# EAGLE design iv4_4lw_1.2 (EAGLE 4.16)
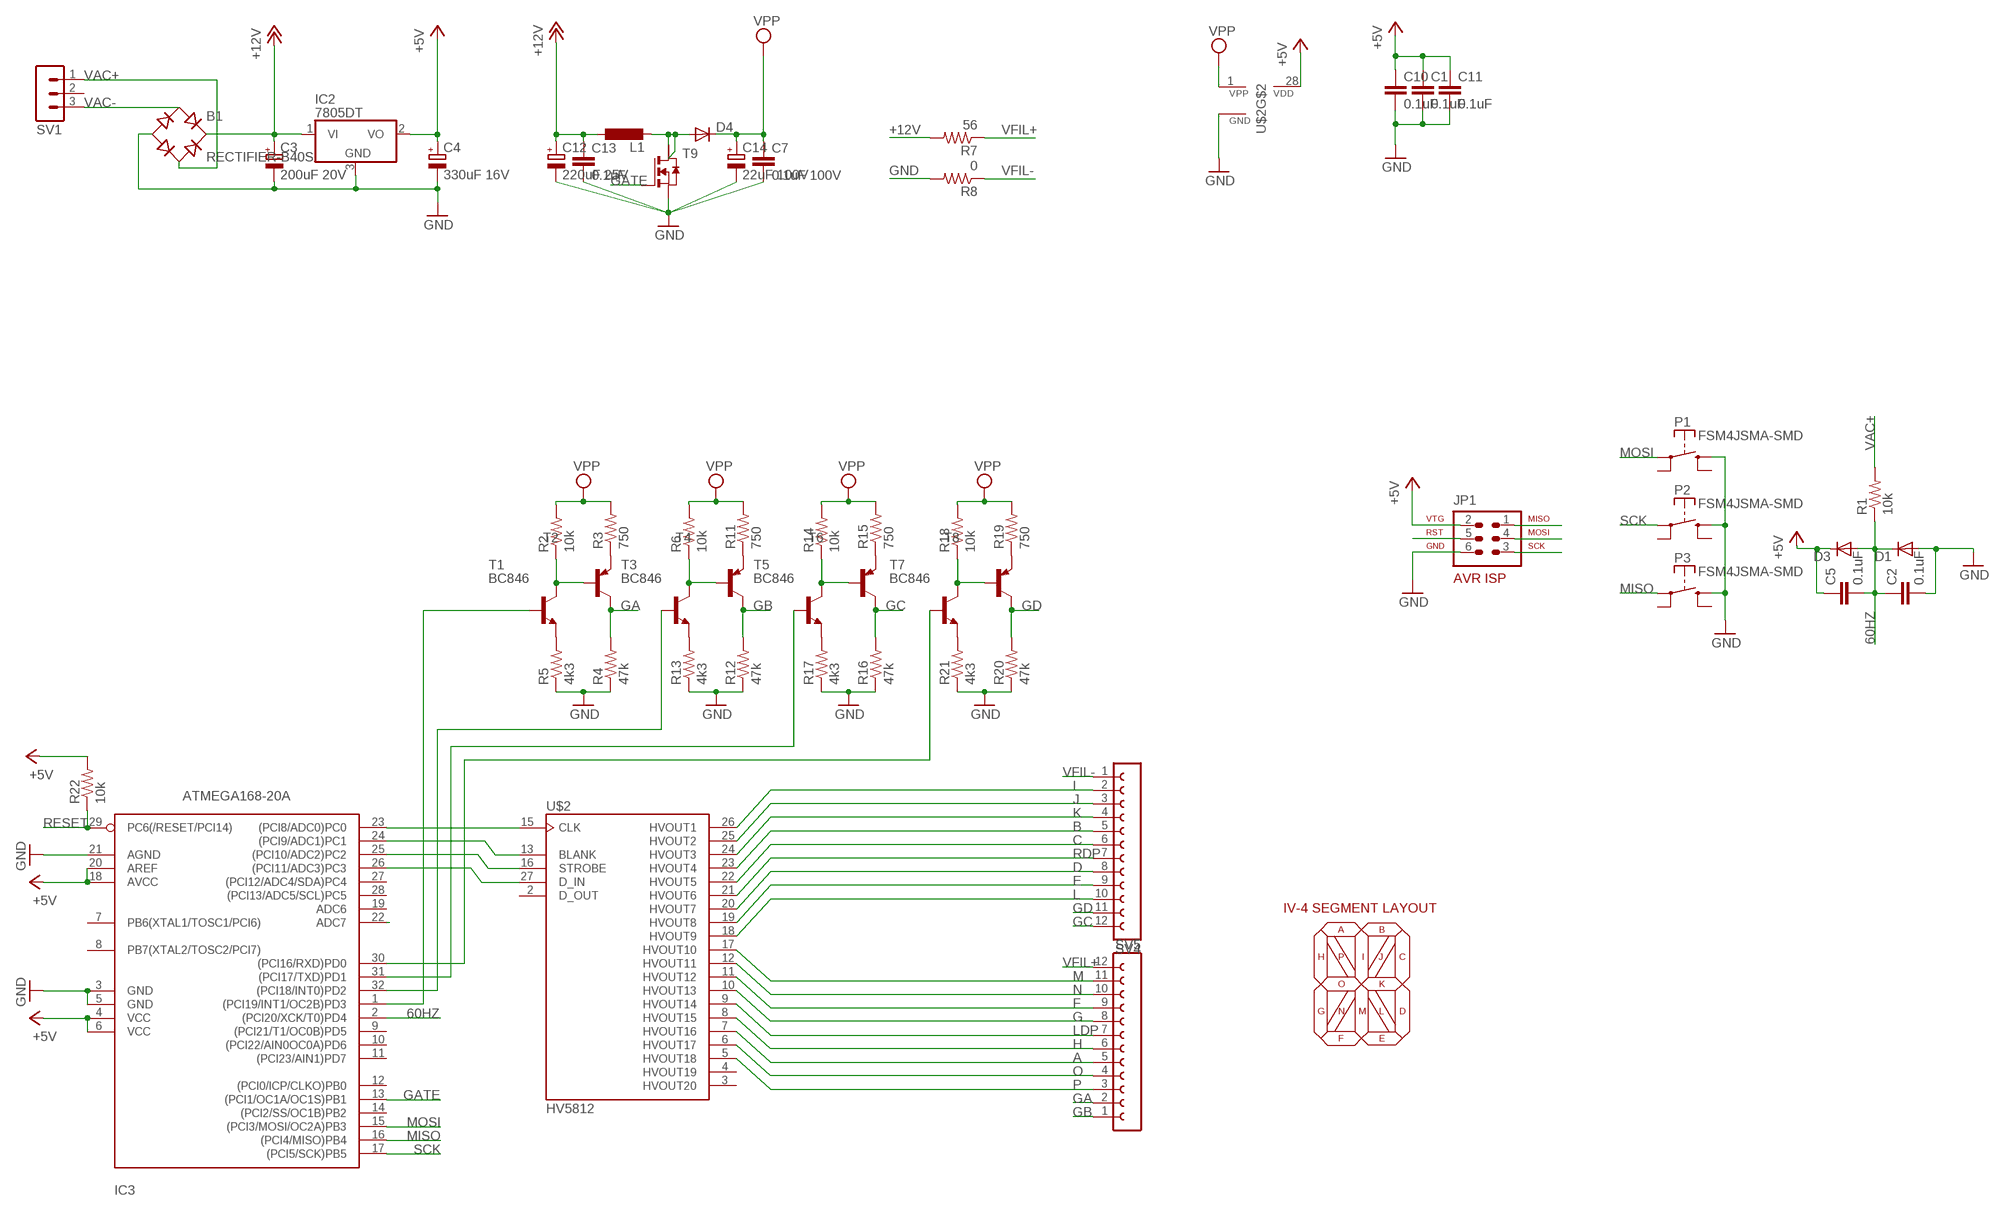
[diagram p0: schematic, sheet 1]

## Parts
B1  RECTIFIER-B40S  [B40S]
C1  0.1uF  C-EUC0805  [C0805]
C2  0.1uF  C-EUC0805  [C0805]
C3  200uF 20V  CPOL-EUE2.5-7  [E2,5-7]
C4  330uF 16V  CPOL-EUE2.5-7  [E2,5-7]
C5  0.1uF  C-EUC0805  [C0805]
C7  0.1uF 100V  C-EUC1206  [C1206]
C10  0.1uF  C-EUC0805  [C0805]
C11  0.1uF  C-EUC0805  [C0805]
C12  220uF 25V  CPOL-EUE2.5-7  [E2,5-7]
C13  0.1uF  C-EUC0805  [C0805]
C14  22uF 100V  CPOL-EUE2.5-7  [E2,5-7]
D1  DIODE-SOD123  [SOD123]
D3  DIODE-SOD123  [SOD123]
D4  DIODE-DO214AC  [DO214AC]
IC2  7805DT  [TO252]
IC3  ATMEGA168-20A  [TQFP32-08]
JP1  AVR-ISP-6  [AVR-ISP-6]
L1  DO3316P  [DO3316P]
P1  FSM4JSMA-SMD  [FSM4JSMA-SMD]
P2  FSM4JSMA-SMD  [FSM4JSMA-SMD]
P3  FSM4JSMA-SMD  [FSM4JSMA-SMD]
R1  10k  R-US_R0805  [R0805]
R2  10k  R-US_R0805  [R0805]
R3  750  R-US_R0805  [R0805]
R4  47k  R-US_R0805  [R0805]
R5  4k3  R-US_R0805  [R0805]
R6  10k  R-US_R0805  [R0805]
R7  56  R-US_M0805  [M0805]
R8  0  R-US_M0805  [M0805]
R11  750  R-US_R0805  [R0805]
R12  47k  R-US_R0805  [R0805]
R13  4k3  R-US_R0805  [R0805]
R14  10k  R-US_R0805  [R0805]
R15  750  R-US_R0805  [R0805]
R16  47k  R-US_R0805  [R0805]
R17  4k3  R-US_R0805  [R0805]
R18  10k  R-US_R0805  [R0805]
R19  750  R-US_R0805  [R0805]
R20  47k  R-US_R0805  [R0805]
R21  4k3  R-US_R0805  [R0805]
R22  10k  R-US_R0805  [R0805]
SV1  MA03-1  [MA03-1]
SV4  FE12-1  [FE12]
SV5  FE12-1  [FE12]
T1  BC846  [SOT23]
T2  BC856A-PNP-SOT23-BEC  [SOT23-BEC]
T3  BC846  [SOT23]
T4  BC856A-PNP-SOT23-BEC  [SOT23-BEC]
T5  BC846  [SOT23]
T6  BC856A-PNP-SOT23-BEC  [SOT23-BEC]
T7  BC846  [SOT23]
T8  BC856A-PNP-SOT23-BEC  [SOT23-BEC]
T9  NMOSSOT223  [SOT223]
U$2  HV5812  [SO28W]

## Nets
60HZ: C2.1 C5.2 D1.C D3.A IC3.2((PCI20/XCK/T0)PD4) R1.1
+5V: C1.1 C4.+ C5.1 C10.1 C11.1 D3.C IC2.2(VO) IC3.4(VCC) IC3.6(VCC) IC3.18(AVCC) IC3.20(AREF) JP1.2 R22.2 U$2.28(VDD)
+12V: B1.+ C3.+ C12.+ C13.1 IC2.1(VI) L1.2 R7.2
A: SV5.5 U$2.7(HVOUT16)
B: SV4.5 U$2.23(HVOUT4)
BLANK: IC3.24((PCI9/ADC1)PC1) U$2.13(BLANK)
C: SV4.6 U$2.22(HVOUT5)
CLK: IC3.23((PCI8/ADC0)PC0) U$2.15(CLK)
D: SV4.8 U$2.20(HVOUT7)
DIN: IC3.26((PCI11/ADC3)PC3) U$2.27(D_IN)
E: SV4.9 U$2.19(HVOUT8)
F: SV5.9 U$2.11(HVOUT12)
G: SV5.8 U$2.10(HVOUT13)
GA: R4.2 SV5.2 T2.C
GATE: IC3.13((PCI1/OC1A/OC1S)PB1) T9.1(G)
GB: R12.2 SV5.1 T4.C
GC: R16.2 SV4.12 T6.C
GD: R20.2 SV4.11 T8.C
GND: B1.- C1.2 C2.2 C3.- C4.- C7.2 C10.2 C11.2 C12.- C13.2 C14.- D1.A IC2.3(GND) IC3.3(GND) IC3.5(GND) IC3.21(AGND) JP1.6 P1.P$3(S) P2.P$3(S) P3.P$3(S) R4.1 R5.1 R8.2 R12.1 R13.1 R16.1 R17.1 R20.1 R21.1 T9.3(S) U$2.14(GND)
H: SV5.6 U$2.8(HVOUT15)
I: SV4.2 U$2.26(HVOUT1)
J: SV4.3 U$2.25(HVOUT2)
K: SV4.4 U$2.24(HVOUT3)
L: SV4.10 U$2.18(HVOUT9)
LDP: SV5.7 U$2.9(HVOUT14)
M: SV5.11 U$2.17(HVOUT10)
MISO: IC3.16((PCI4/MISO)PB4) JP1.1 P3.P$1(P)
MOSI: IC3.15((PCI3/MOSI/OC2A)PB3) JP1.4 P1.P$1(P)
N: SV5.10 U$2.12(HVOUT11)
N$1: D4.A L1.1 T9.2(D) T9.4(D2)
N$6: R2.1 T1.3(C) T2.B
N$7: R3.1 T2.E
N$8: R5.2 T1.2(E)
N$15: R6.1 T3.3(C) T4.B
N$16: R11.1 T4.E
N$17: R13.2 T3.2(E)
N$19: R14.1 T5.3(C) T6.B
N$20: R15.1 T6.E
N$21: R17.2 T5.2(E)
N$23: R18.1 T7.3(C) T8.B
N$24: R19.1 T8.E
N$25: R21.2 T7.2(E)
N$26: IC3.1((PCI19/INT1/OC2B)PD3) T1.1(B)
N$27: IC3.32((PCI18/INT0)PD2) T3.1(B)
N$28: IC3.31((PCI17/TXD)PD1) T5.1(B)
N$29: IC3.30((PCI16/RXD)PD0) T7.1(B)
O: SV5.4 U$2.6(HVOUT17)
P: SV5.3 U$2.5(HVOUT18)
RDP: SV4.7 U$2.21(HVOUT6)
RESET: IC3.22(ADC7) IC3.29(PC6(/RESET/PCI14)) JP1.5 R22.1
SCK: IC3.17((PCI5/SCK)PB5) JP1.3 P2.P$1(P)
STROBE: IC3.25((PCI10/ADC2)PC2) U$2.16(STROBE)
VAC+: B1.AC2 R1.2 SV1.1
VAC-: B1.AC1 SV1.3
VFIL+: R7.1 SV5.12
VFIL-: R8.1 SV4.1
VPP: C7.1 C14.+ D4.C R2.2 R3.2 R6.2 R11.2 R14.2 R15.2 R18.2 R19.2 U$2.1(VPP)
Unconnected: IC3.7(PB6(XTAL1/TOSC1/PCI6)) IC3.8(PB7(XTAL2/TOSC2/PCI7)) IC3.9((PCI21/T1/OC0B)PD5) IC3.10((PCI22/AIN0OC0A)PD6) IC3.11((PCI23/AIN1)PD7) IC3.12((PCI0/ICP/CLKO)PB0) IC3.14((PCI2/SS/OC1B)PB2) IC3.19(ADC6) IC3.27((PCI12/ADC4/SDA)PC4) IC3.28((PCI13/ADC5/SCL)PC5) P1.P$2(P) P1.P$4(S) P2.P$2(P) P2.P$4(S) P3.P$2(P) P3.P$4(S) SV1.2 U$2.2(D_OUT) U$2.3(HVOUT20) U$2.4(HVOUT19)

## Notes on the sheet
- IV-4 SEGMENT LAYOUT
- A | B
- H | P | I | J | C
- O | K
- G | N | M | L | D
- F | E

## Library data of the parts
B1 = rectifier:RECTIFIER-: Rectifier
C1 C2 C5 C7 C10 C11 C13 = rcl:C-EU: CAPACITOR, European symbol
C3 C4 C12 C14 = rcl:CPOL-EU: POLARIZED CAPACITOR, European symbol
D1 D3 D4 = diode:DIODE-: DIODE
IC2 = linear:78*: Positive VOLTAGE REGULATOR Source: http://cache.national.com/ds/LM/LM78L05.pdf http://www.fairchildsemi.com/ds/LM/LM7805.pdf
IC3 = avr:ATMEGA168: MICROCONTROLLER 16 kBytes FLASH 1 kBytes SRAM 512 Bytes EEPROM USART 8-channel 10 bit ADC
JP1 = atmel:AVR-ISP-6: AVR ISP-6 Serial Programming Header
L1 = inductor-coilcraft:DO3316P: COILCRAFT
P1-P3 = switch-misc:FSM4JSMA-SMD: TYCO SWITCH
R1-R8 R11-R22 = rcl:R-US_: RESISTOR, American symbol
SV1 = con-lstb:MA03-1: PIN HEADER
SV4 SV5 = con-lsta:FE12-1: FEMALE HEADER
T1 T3 T5 T7 = transistor:BC846: NPN TRANSISTOR
T2 T4 T6 T8 = transistor:*-PNP-: PNP Transistror
T9 = zetex:NMOSSOT223: MOS FET
U$2 = supertex-hv:HV5812

## Board
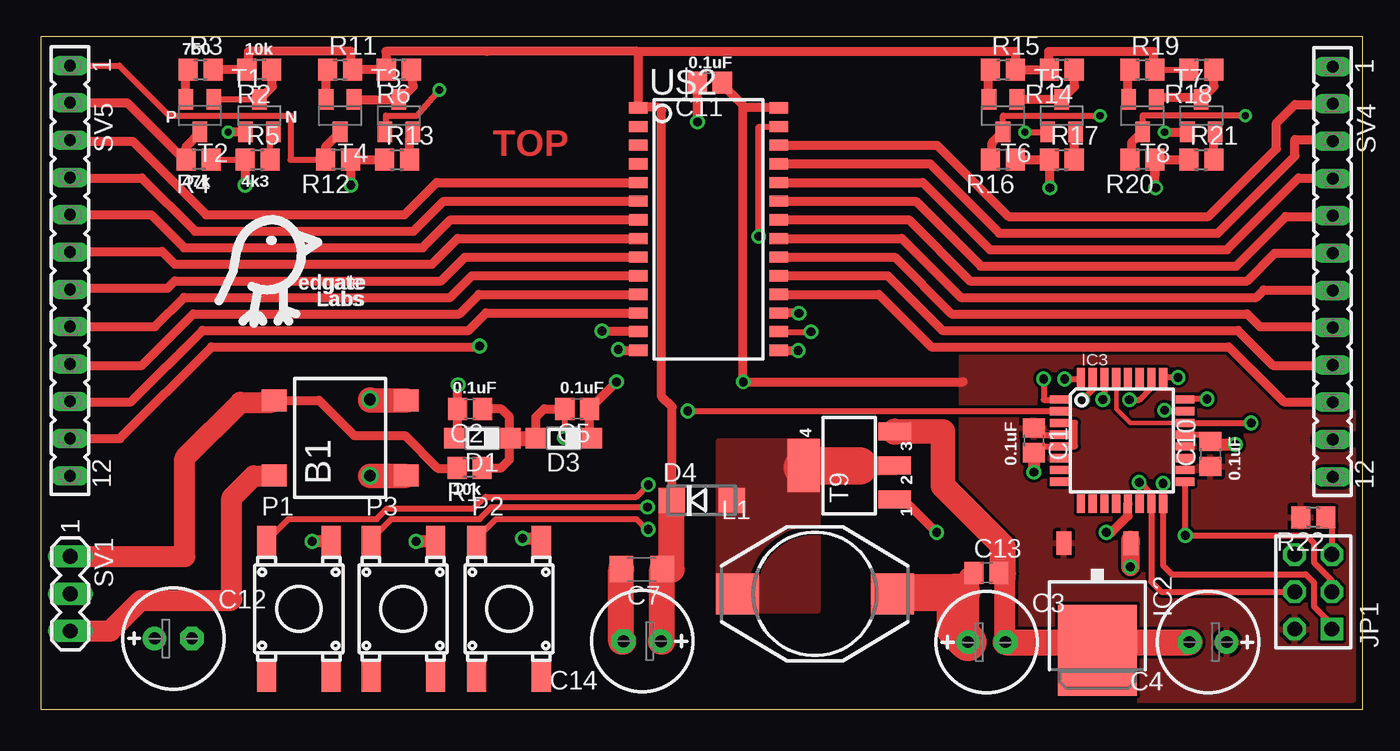
[diagram p1: board, top side]
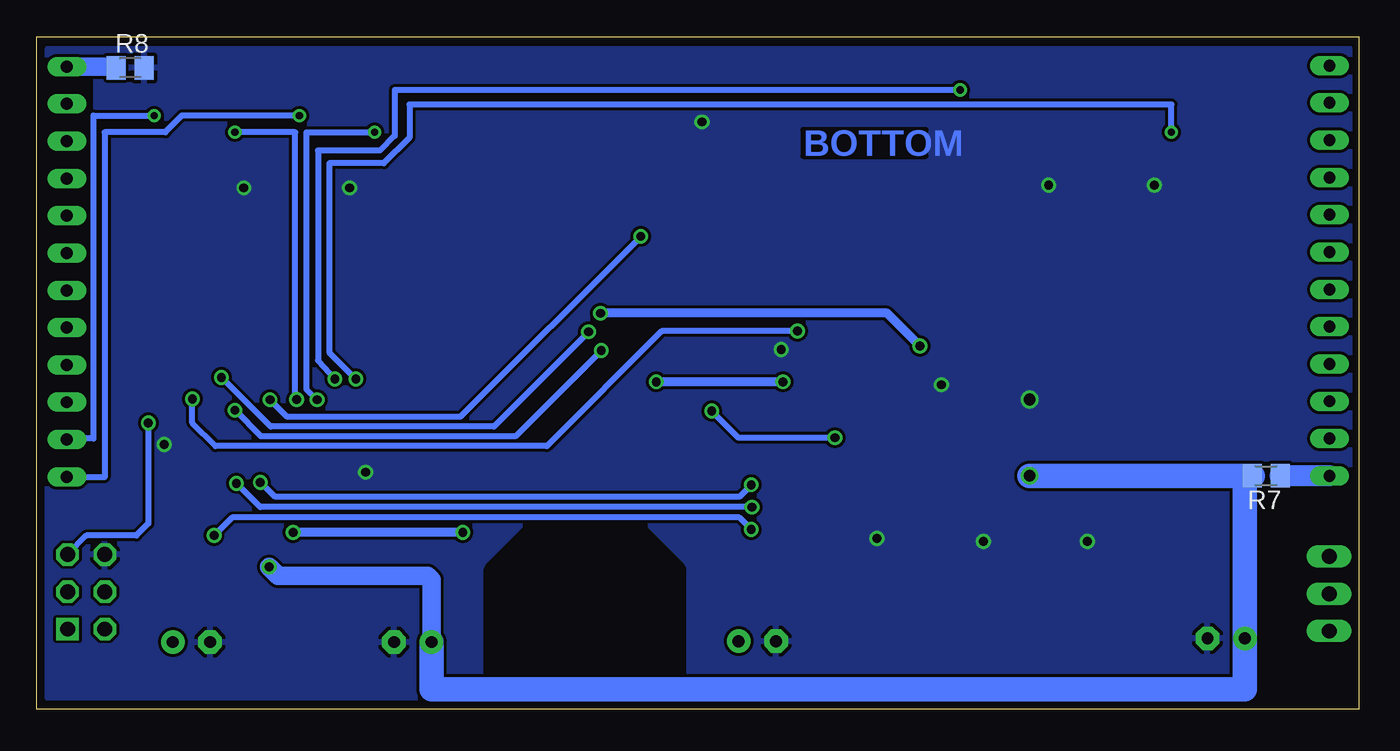
[diagram p2: board, bottom side, seen from below]

Size 90 x 45.81 mm. Coordinates in mm from the lower left corner, seen from the top.
Outline: 0,0 90,0 90,45.82 0,45.81 0,0
Copper layers (1*16): Top 0.0356mm / dielectric 1.5011mm / Bottom 0.0356mm
Design rules "default *": minimum track width 10mil, minimum drill 5mil, track to track 8mil, track to pad 0.1727mm, pad to pad 8mil, via to via 8mil, smd to smd 5mil, copper to edge 10mil, drill to drill 8mil, minimum pad ring 10mil, minimum via ring 8mil, stop-mask expansion 4mil, vias tented up to drill 0mil, thermal gap 10mil
tRestrict: 1 lines
bRestrict: 7 lines

### Footprints (pad centres in the part's own frame; a part is rotated, then mirrored left to right if it is on the bottom)
B40S = smd 1.5 x 1.7: + -2.55,-4.5; - 2.55,-4.5; AC1 -2.55,4.5; AC2 2.55,4.5
C0805 = smd 1.3 x 1.5: 1 -0.85,0; 2 0.85,0
E2,5-7 = drill 0.813 pad 1.6 round: + -1.27,0 | drill 0.813 pad 1.6 octagon: - 1.27,0
C1206 = smd 1.6 x 1.8: 1 -1.4,0; 2 1.4,0
SOD123 = smd 1.4 x 1.4: A 1.9,0; C -1.9,0
DO214AC = smd 1.8 x 1.7: A 2.05,0; C -2.05,0
TO252 = smd 1 x 1.6: 1 -2.28,-4.8; 2 2.28,-4.8 | smd 5.4 x 6.2: 3 0,2.5
TQFP32-08 = smd 1.27 x 0.559: 1 -4.293,2.8; 2 -4.293,2; 3 -4.293,1.2; 4 -4.293,0.4; 5 -4.293,-0.4; 6 -4.293,-1.2; 7 -4.293,-2; 8 -4.293,-2.8; 17 4.293,-2.8; 18 4.293,-2; 19 4.293,-1.2; 20 4.293,-0.4; 21 4.293,0.4; 22 4.293,1.2; 23 4.293,2; 24 4.293,2.8 | smd 0.559 x 1.27: 9 -2.8,-4.293; 10 -2,-4.293; 11 -1.2,-4.293; 12 -0.4,-4.293; 13 0.4,-4.293; 14 1.2,-4.293; 15 2,-4.293; 16 2.8,-4.293; 25 2.8,4.293; 26 2,4.293; 27 1.2,4.293; 28 0.4,4.293; 29 -0.4,4.293; 30 -1.2,4.293; 31 -2,4.293; 32 -2.8,4.293
AVR-ISP-6 = drill 1.016 square: 1 -2.54,-1.27 | drill 1.016 octagon: 2 -2.54,1.27; 3 0,-1.27; 4 0,1.27; 5 2.54,-1.27; 6 2.54,1.27
DO3316P = smd 2.92 x 2.79: 1 -5.28,0; 2 5.28,0
FSM4JSMA-SMD = smd 1.3 x 2.1: P$1 -2.196,4.584; P$2 -2.196,-4.6; P$3 2.204,4.584; P$4 2.204,-4.6
R0805 = smd 1.3 x 1.5: 1 -0.85,0; 2 0.85,0
M0805 = smd 1.3 x 1.6: 1 -0.95,0; 2 0.95,0
MA03-1 = drill 1.016 long: 1 -2.54,0; 2 0,0; 3 2.54,0
FE12 = drill 0.813 long: 1 -13.97,0; 2 -11.43,0; 3 -8.89,0; 4 -6.35,0; 5 -3.81,0; 6 -1.27,0; 7 1.27,0; 8 3.81,0; 9 6.35,0; 10 8.89,0; 11 11.43,0; 12 13.97,0
SOT23 = smd 1 x 1.4: 1 -0.95,-1.1; 2 0.95,-1.1; 3 0,1.1
SOT23-BEC = smd 1 x 1.4: B -0.95,-1.1; C 0,1.1; E 0.95,-1.1
SOT223 = smd 1.219 x 2.235: 1 -2.311,-3.099; 2 0,-3.099; 3 2.311,-3.099 | smd 3.6 x 2.2: 4 0,3.099
SO28W = smd 0.762 x 1.27: 1 -8.89,-4.78; 2 -7.62,-4.78; 3 -6.35,-4.78; 4 -5.08,-4.78; 5 -3.81,-4.78; 6 -2.54,-4.78; 7 -1.27,-4.78; 8 0,-4.78; 9 1.27,-4.78; 10 2.54,-4.78; 11 3.81,-4.78; 12 5.08,-4.78; 13 6.35,-4.78; 14 7.62,-4.78; 15 7.62,4.78; 16 6.35,4.78; 17 5.08,4.78; 18 3.81,4.78; 19 2.54,4.78; 20 1.27,4.78; 21 0,4.78; 22 -1.27,4.78; 23 -2.54,4.78; 24 -3.81,4.78; 25 -5.08,4.78; 26 -6.35,4.78; 27 -7.62,4.78; 28 -8.89,4.78

### Placement (x,y rotation side)
B1  20.37,18.5 90 top
C1  67.61,18.33 270 top
C2  29.22,20.46 180 top
C3  64.4,4.59 0 top
C4  79.46,4.59 180 top
C5  36.52,20.48 180 top
C7  40.9,9.55 180 top
C10  79.63,17.4 90 top
C11  45.54,42.68 180 top
C12  9.02,4.83 0 top
C13  64.39,9.31 0 top
C14  40.94,4.65 180 top
D1  30.05,18.47 180 top
D3  35.61,18.47 180 top
D4  45,14.22 0 top
IC2  71.93,6.54 180 top
IC3  73.61,18.31 0 top
JP1  86.63,8.01 90 top
L1  52.7,7.87 0 top
P1  17.57,6.85 0 top
P2  31.87,6.85 0 top
P3  24.67,6.85 0 top
R1  29.18,16.46 180 top
R2  14.88,43.56 180 top
R3  10.88,43.56 0 top
R4  10.75,37.44 180 top
R5  14.75,37.44 0 top
R6  24.38,43.56 180 top
R7  6.29,15.92 180 bottom
R8  83.64,43.7 0 bottom
R11  20.38,43.56 0 top
R12  20.25,37.44 180 top
R13  24.25,37.44 0 top
R14  69.5,43.56 180 top
R15  65.5,43.56 0 top
R16  65.5,37.44 180 top
R17  69.5,37.44 0 top
R18  79,43.56 180 top
R19  75,43.56 0 top
R20  75,37.44 180 top
R21  79,37.44 0 top
R22  86.63,13.07 180 top
SV1  2,7.88 270 top
SV4  87.95,29.81 270 top
SV5  1.98,29.88 270 top
T1  14.88,40.44 0 top
T2  10.83,40.44 180 top
T3  24.38,40.44 0 top
T4  20.38,40.44 180 top
T5  69.5,40.44 0 top
T6  65.5,40.44 180 top
T7  79,40.44 0 top
T8  75,40.44 180 top
T9  55.03,16.61 90 top
U$2  45.46,32.08 270 top

### Tracks (layer width: path | path; a pad name or v marks a point on that pad's centre or on a via)
60HZ  (via drill 0.6)
  Top 0.406: D3.A 33.79,18.47 33.79,18.48 | C5.2 v35.66,18.5 | IC3.2 69.31,20.31 69.29,20.33 v44.05,20.33
  Top 0.61: C2.1 31.35,20.46 31.9,19.91 31.9,18.41 | C5.2 34.27,20.48 33.7,19.91 33.7,18.61 33.8,18.51 33.75,18.47 D3.A | R1.1 31.35,16.46 31.9,17.01 31.9,18.41 | 31.9,18.41 D1.C
  Top 1.016: D3.A 33.65,18.47 33.6,18.51 33.56,18.47 D1.C
  Bottom 0.406: v35.66,18.5 42.22,18.5 v44.05,20.33
+5V  (via drill 0.6)
  Top 0.406: 69.33,18.7 69.36,18.7 | 69.33,18.7 IC3.4 | C1.1 67.8,18.7 69.33,18.7
  Top 0.61: U$2.28 50.24,41.01 47.82,41.01 | 47.82,41.01 47.95,41.01 46.33,42.63 C11.1 | D3.C 37.51,18.51 37.37,18.65 C5.1 v39.2,22.31 | 47.82,41.01 v47.82,22.31 62.79,22.31
  Bottom 0.61: v39.2,22.31 v47.82,22.31
  pour Top (isolate 0.203): 89.36,0.67 89.36,24.7 62.69,24.7 62.69,0.67
+12V  (via drill 0.6, 0.8)
  Top 1.27: 63.2,4.63 63.18,4.63 C3.+ | 63.2,8.97 C13.1 | IC2.1 74.21,11.5 74.17,11.54 v74.17,9.71
  Top 1.422: 24.8,15.91 24.84,15.95 B1.+ | 63.2,4.63 63.2,8.97
  Top 1.676: v22.4,15.91 24.8,15.91
  Top 2.54: 57.91,7.93 57.76,7.93 | 57.91,7.93 L1.2 | C3.+ 62.27,5.44 62.27,7.96 62.66,7.96 57.91,7.93
  Bottom 0.254: 22.41,15.93 22.41,15.92 v22.41,15.91 v22.4,15.91
  Bottom 0.61: 7.75,4.81 7.72,4.83 7.72,4.84 C12.+
  Bottom 1.27: C3.+ 63.13,8.83 63.4,9.1 73.56,9.1 v74.17,9.71
  Bottom 1.676: 7.22,15.91 7.23,15.92 R7.2 7.71,15.92 7.75,15.89 C12.+ | 7.22,15.91 v22.4,15.91 | 7.22,15.91 | 7.75,4.81 7.75,1.35 63.12,1.35 63.12,4.58 C3.+
A
  Top 0.61: U$2.7 27.91,33.35 26,31.44 9.75,31.44 7.5,33.69 6.13,33.69 | 1.88,33.69 SV5.5 6.13,33.69 | 6.13,33.69 6.25,33.69
B
  Top 0.61: U$2.23 59.57,34.62 64,30.19 81.38,30.19 84.75,33.56 87.89,33.56 SV4.5
BLANK  (via drill 0.6)
  Top 0.406: IC3.24 77.91,21.14 v79.4,21.14
  Top 0.61: U$2.13 40.64,25.76 v38.2,25.76
  Bottom 0.406: v38.2,25.76 47.45,25.76 55.27,17.94 77.83,17.94 79.4,19.52 v79.4,21.14 79.35,21.14
C
  Top 0.61: U$2.22 59.1,33.35 63.25,29.19 82.13,29.19 84,31.06 87.94,31.06 SV4.6
CLK  (via drill 0.6)
  Top 0.406: 50.25,24.44 U$2.15 50.24,24.44 | 77.88,20.33 IC3.23 77.91,20.31 77.93,20.33 76.51,20.33 v76.51,20.38
  Top 0.61: 50.24,24.44 v51.56,24.44
  Bottom 0.406: v51.56,24.44 57.41,18.6 74.73,18.6 v76.51,20.38
D
  Top 0.61: U$2.20 58.14,30.81 62,26.94 82.13,26.94 83,26.06 87.63,26.06 87.75,25.94 87.81,26 SV4.8
DIN  (via drill 0.6)
  Top 0.406: IC3.26 75.61,21.92 74.78,21.09 v74.12,21.09 | v48.87,32.22 48.87,39.68 50.19,39.68 50.21,39.7 U$2.27
  Bottom 0.406: v74.12,21.09 72.95,19.92 61.17,19.92 v48.87,32.22
E
  Top 0.61: U$2.19 57.66,29.54 61.38,25.81 81.5,25.81 83.88,23.44 87.93,23.44 SV4.9
F
  Top 0.61: SV5.9 1.98,23.54 2,23.56 2.13,23.44 6.88,23.44 10.38,26.94 28.5,26.94 29.83,28.27 U$2.11
G
  Top 0.61: U$2.10 29.35,29.54 27.88,28.06 9.75,28.06 7.75,26.06 2.13,26.06 2.12,26.07 SV5.8
GA
  Top 0.406: SV5.2 | 10.83,39.26 T2.C
  Top 0.61: 10.83,39.26 9.9,38.34 R4.2 9.75,37.44 5.88,41.31 2,41.31 SV5.2
GATE  (via drill 0.6)
  Top 0.61: T9.1 58.14,14.28 58.75,14.28 v60.99,12.05 | v72.54,12.05 72.9,12.05 74.02,13.17 74.02,14.03 IC3.13
  Bottom 0.61: v60.99,12.05 v72.54,12.05
GB
  Top 0.406: SV5.1 5.34,43.85 8.75,40.44 17,40.44 17,37.44 R12.2
  Top 0.61: T4.C 20.38,39.31 19.4,38.34 R12.2
GC  (via drill 0.5)
  Top 0.406: R16.2 64.75,37.54 | 64.75,37.54 64.75,38.59 | 64.75,37.54 64.73,37.56 | 64.75,38.56 65.5,39.31 65.5,40.44 v72.13,40.44
  Top 0.61: 64.75,38.59 T6.C | 64.75,37.54 64.75,38.56
  Bottom 0.406: v72.13,40.44 80.13,40.44 81.25,39.31 85.38,39.31 85.38,15.81 87.95,15.81 SV4.12
GD  (via drill 0.5)
  Top 0.406: 74.25,37.31 R20.2 | 74.25,37.31 74.25,38.59 | 74.25,37.31 74.25,37.44 | 74.25,38.56 75,39.31 75,40.44 v82,40.44
  Top 0.61: 74.25,38.59 T8.C | 74.25,38.56 74.25,37.31
  Bottom 0.406: v82,40.44 86.13,40.44 86.13,18.44 88,18.44 88,18.38 SV4.11
GND  (via drill 0.6, 0.8)
  Top 0.406: R4.1 R5.1 | R12.1 21.13,37.41 | 77.8,18.71 77.8,18.76 | IC3.21 77.8,18.71 | 77.8,18.71 77.8,18.64 | C1.2 67.59,17.45 67.62,17.45 | C1.2 67.59,17.48 | C1.2 67.77,17.91 IC3.5 70.41,17.91 70.41,19.52 69.34,19.52 69.34,19.51 IC3.3 | IC3.21 77.89,18.7 | IC3.21 79.41,18.71 79.8,18.33 79.85,17.94 79.84,17.95 C10.2 | C13.2 65.23,9.3 | C13.2 | C13.2 65.48,9.31 | C13.2
  Top 0.61: R13.1 R12.1 v21.1,35.71 | R16.1 R17.1 68.65,35.56 v68.7,35.51 | R20.1 R21.1 | R5.1 v13.9,35.71 | R20.1 75.85,36.36 | 75.85,35.61 75.85,35.56 | 75.85,35.61 R20.1 | 75.8,35.51 v75.9,35.51 75.9,35.61 75.85,35.61 | D1.A 28.37,18.69 C2.2 28.37,22.09 v28.4,22.11 | U$2.14 39.37,24.46 v39.31,24.51 | C11.2 v44.7,40.02 v44.7,40.01 | C4.- 78.23,4.59 78.23,4.58 C4.-
  Top 0.813: P3.P$3 25.95,11.43 v25.54,11.44 | P2.P$3 33.79,11.64 v32.79,11.64 | 79.83,18.04 79.81,18.04 | C10.2 79.83,18.04 | 79.83,18.04 v81.33,18.04 | 67.62,17.45 v67.62,16.16 | 18.4,11.44 18.39,11.44 | 18.4,11.44 v18.48,11.44 | P1.P$3 18.4,11.43 18.4,11.44
  Top 1.27: C3.- 65.64,4.62 | 65.64,8.92 C13.2
  Top 1.422: 65.64,4.62 65.64,8.92
  Top 1.676: B1.- 22.4,21.05 v22.4,21.11 | 61.42,18.92 58.17,18.92 | 61.42,18.92 61.42,18.93 | 65.48,11.08 65.51,11.08 65.53,11.11 61.42,15.22 61.42,18.92
  Top 1.778: C14.- 39.67,4.63 39.5,4.63 C7.2 | C3.- 71.39,4.58 IC2.3 | 72.49,4.58 C4.- | 65.48,11.08 65.48,9.31 65.48,9.2 | T9.3 58.17,18.92 58.17,18.91
  pour Bottom (isolate 0.203): 0.63,45.01 0.63,0.81 89.25,0.75 89.25,45
H
  Top 0.61: U$2.8 28.39,32.08 26.63,30.31 9.13,30.31 8.25,31.19 2,31.19 1.98,31.17 SV5.6
I
  Top 0.61: U$2.26 61.02,38.43 65.88,33.56 79.5,33.56 84.13,38.19 84.13,39.94 85.38,41.19 87.63,41.19 87.75,41.31 87.83,41.24 SV4.2
J
  Top 0.61: U$2.25 60.53,37.16 65.25,32.44 80.13,32.44 85.38,37.69 85.38,38.81 88,38.81 88,38.75 SV4.3
K
  Top 0.61: U$2.24 60.06,35.89 64.63,31.31 80.75,31.31 85.63,36.19 87.92,36.19 SV4.4
L
  Top 0.61: U$2.18 57.05,28.27 60.63,24.69 80.88,24.69 84.63,20.94 87.88,20.94 87.89,20.92 SV4.10
LDP
  Top 0.61: U$2.9 28.87,30.81 27.25,29.19 9.13,29.19 8.63,28.69 2.13,28.69 2,28.56 1.98,28.58 SV5.7
M  (via drill 0.6)
  Top 0.406: 1.98,18.42 1.88,18.31 | 1.98,18.42 2,18.44 | SV5.11 1.98,18.42
  Top 0.61: 2,18.44 5.38,18.44 11.63,24.69 29.81,24.69 v29.87,24.75 | 50.26,26.98 50.4,26.98 | 50.26,26.98 U$2.17 | v51.62,26.98 50.26,26.98
  Bottom 0.61: v51.62,26.98 32.11,26.98 v29.87,24.75
MISO  (via drill 0.6)
  Top 0.406: JP1.1 87.9,5.78 86.67,7.02 86.67,8.64 86.11,9.2 77.02,9.2 76.41,9.81 76.41,13.88 | 76.41,14.03 IC3.16 76.41,13.88 | v76.41,15.4 76.41,13.88 | 22.46,11.64 P3.P$1 22.47,11.52 22.46,11.54 23.88,12.96 29.87,12.96 30.69,13.78 v41.3,13.78
  Bottom 0.406: v41.3,13.78 74.78,13.78 v76.41,15.4
MOSI  (via drill 0.6)
  Top 0.406: 75.59,14.02 75.59,14.08 | 75.59,14.02 IC3.15 75.61,14.72 74.88,15.45 v74.78,15.45 | JP1.4 76.28,8.01 75.59,8.7 75.59,14.02 | 15.34,11.64 15.35,11.64 P1.P$1 15.35,11.43 15.34,11.44 16.87,12.96 22.86,12.96 23.57,13.67 29.47,13.67 30.28,14.49 40.54,14.49 v41.35,15.3
  Bottom 0.406: v74.78,15.45 74.68,15.4 73.76,14.49 42.17,14.49 v41.35,15.3
N
  Top 0.61: SV5.10 2.05,20.99 2.13,21.06 2.25,20.94 6.13,20.94 11,25.81 29.13,25.81 30.31,27 U$2.12
N$1
  Top 1.27: T9.2 58.13,16.57 55.73,16.57
  Top 2.54: 51.93,16.57 51.87,16.47 | T9.4 51.93,16.57 | 51.93,16.57 55.73,16.57
  pour Top (no thermals): 46.18,6.71 46.18,18.3 52.89,18.3 52.89,6.71
N$6
  Top 0.406: T1.3 14.78,41.54 14.75,41.57 11.84,41.56 T2.B | 15.75,43.29 R2.1
  Top 0.61: T1.3 15.75,42.41 15.75,43.29
N$7
  Top 0.406: 9.88,43.41 R3.1
  Top 0.61: T2.E 9.88,43.41
N$8
  Top 0.406: R5.2 15.63,37.69 15.63,39.14 T1.2
N$15
  Top 0.406: T3.3 24.35,41.41 | T4.B 21.35,41.29 21.38,41.31 21.28,41.54
  Top 0.61: R6.1 25.35,42.41 24.35,41.41 | 21.28,41.54 T3.3
N$16
  Top 0.406: R11.1 19.5,43.56 19.43,43.49
  Top 0.61: T4.E 19.43,43.49
N$17
  Top 0.406: T3.2 25.2,39.11 25.13,39.19 25.1,38.79
  Top 0.61: R13.2 25.1,38.79
N$19
  Top 0.406: 69.48,41.56 T5.3 | T6.B 66.48,41.56 | 70.38,43.54 R14.1
  Top 0.61: 66.48,41.56 69.48,41.56 | T5.3 70.38,42.41 70.38,43.54
N$20
  Top 0.406: 64.5,43.44 64.53,43.44 R15.1 | T6.E 64.5,41.59
  Top 0.61: 64.5,41.59 64.5,43.44
N$21
  Top 0.406: 70.38,39.26 T5.2 | R17.2 70.38,37.46
  Top 0.61: 70.38,37.46 70.38,39.26
N$23
  Top 0.406: 79,41.69 T7.3 | T8.B 75.98,41.69 | 79.88,43.54 R18.1
  Top 0.61: 75.98,41.69 79,41.69 | T7.3 79.88,42.41 79.88,43.54
N$24
  Top 0.406: 74,43.44 74.03,43.44 R19.1 | T8.E 74,41.71
  Top 0.61: 74,41.71 74,43.44
N$25
  Top 0.406: 79.88,39.39 T7.2 | R21.2 79.88,37.34
  Top 0.61: 79.88,37.34 79.88,39.39
N$26  (via drill 0.5, 0.6)
  Top 0.406: T1.1 13.93,39.31 | IC3.1 69.29,21.09 68.28,21.09 v68.28,22.51
  Top 0.61: 13.93,39.31 v12.75,39.31
  Bottom 0.406: v12.75,39.31 12.75,41.19 64.63,41.19 64.63,38.94 66.38,37.19 70.08,37.19 70.08,24.32 v68.28,22.51
N$27  (via drill 0.5, 0.6)
  Top 0.406: T3.1 23.5,39.41 23.5,40.44 25.63,40.44 v27.13,42.19 | IC3.32 70.72,22.51 v69.7,22.51
  Bottom 0.406: v27.13,42.19 65.63,42.19 65.63,39.06 66.63,38.06 70.85,38.06 70.85,23.77 v69.7,22.51
N$28  (via drill 0.5, 0.6)
  Top 0.406: 68.53,39.31 arc90 T5.1 68.53,39.34 68.5,39.31 v67,39.31 | 71.53,22.72 71.53,22.69 IC3.31 | 71.63,22.51 71.6,22.51 IC3.31 | v70.92,21.09 71.63,21.8 71.63,22.61 IC3.31
  Bottom 0.406: v67,39.31 71.63,39.31 71.63,21.8 v70.92,21.1 v70.92,21.09
N$29  (via drill 0.5, 0.6)
  Top 0.406: 78.05,39.31 T7.1 78.03,39.34 78,39.31 | 72.34,22.72 72.34,22.68 IC3.30 | IC3.30 72.44,22.61 72.44,22.64 | IC3.30 72.4,22.63 72.39,21.14 v72.3,21.1
  Top 0.61: v76.5,39.31 78,39.31
  Bottom 0.406: v76.5,39.31 72.4,39.31 72.39,21.14 v72.3,21.1
O
  Top 0.61: U$2.6 27.43,34.62 25.38,32.56 10.5,32.56 6.88,36.19 2,36.19 1.98,36.21 SV5.4
P
  Top 0.61: SV5.3 1.98,38.79 2,38.81 2.13,38.69 6.25,38.69 11.25,33.69 24.75,33.69 26.95,35.89 U$2.5
RDP
  Top 0.61: U$2.21 58.61,32.08 62.63,28.06 82.75,28.06 83.25,28.56 87.97,28.56 | 87.97,28.56 88,28.56 | 87.97,28.56 SV4.7
RESET  (via drill 0.6)
  Top 0.305: IC3.29 73.21,20.47 74.17,19.52 77.93,19.52
  Top 0.406: 77.93,19.52 77.93,19.51 IC3.22 v82.4,19.51 | 87.89,10.52 JP1.5 87.93,10.57 87.94,10.57 87.94,12.62 R22.1
  Bottom 0.406: JP1.5 87.9,10.56 86.62,11.84 83.21,11.84 82.4,12.66 v82.4,19.51
SCK  (via drill 0.6)
  Top 0.406: 78.05,15.51 IC3.17 77.93,15.51 v77.93,11.84 86.16,11.84 86.67,11.34 86.67,10.02 87.89,8.8 87.89,7.99 | 87.86,8.01 JP1.3 87.89,7.99 | 87.89,7.99 87.89,7.98 | 29.67,11.64 P2.P$1 29.67,11.64 30.99,12.96 40.54,12.96 41.25,12.25 v41.35,12.25
  Bottom 0.406: v77.93,11.84 76.71,13.06 42.17,13.06 v41.35,12.25
STROBE  (via drill 0.6)
  Top 0.406: IC3.25 v77.41,22.61 v77.42,22.61 | 50.29,25.71 v52.43,25.71 | 50.29,25.71 50.28,25.73 U$2.16 | 50.29,25.71 50.24,25.71
  Bottom 0.406: v77.42,22.61 74.07,19.26 58.88,19.26 v52.43,25.71
VAC+
  Top 0.61: B1.AC2 18.94,21.05 21.34,18.65 24.79,18.65 27.03,16.42 28.04,16.42 28.09,16.46 R1.2
  Top 1.422: SV1.1 9.8,10.42 9.8,17.11 13.6,20.91 15.7,20.91 15.84,21.05 B1.AC2
VAC-
  Top 1.422: SV1.3 4.73,5.34 6.8,7.41 12.9,7.41 13,7.51 13,14.41 14.5,15.91 15.6,15.91 15.64,15.95 B1.AC1
VFIL+
  Bottom 1.422: SV5.12 2,15.91 2.01,15.92 R7.1
VFIL-
  Bottom 1.27: R8.1 84.59,43.8 84.6,43.81 84.63,43.78 SV4.1
VPP
  Top 0.406: 14.13,43.66 R2.2 | 21.38,43.59 R11.2 21.13,43.66 | 78.25,43.56 R18.2 R19.2 75.75,43.56 | R14.2 68.63,43.59 | 30.38,44.81 31.81,44.81 | 23.5,43.56 R6.2 | 40.68,44.81 40.63,44.81
  Top 0.61: R2.2 R3.2 | R11.2 23.5,43.56 23.5,44.81 30.38,44.81 40.63,44.81 66.35,44.81 R15.2 R14.2 | 14.13,43.66 14.13,44.81 21.13,44.81 21.13,43.66 | 68.63,43.59 68.63,44.81 75.75,44.81 75.75,43.56 | 40.68,44.81 U$2.1 40.64,41 42.06,41 42.27,40.8 42.27,21.29 42.98,20.58 42.98,14.19 | 42.98,14.19 42.98,14.18 | D4.C 42.98,14.19
  Top 1.27: 42.3,9.51 42.27,9.51 | C7.1 42.3,9.51 | 42.3,9.51 42.95,9.51
  Top 1.778: 42.95,9.51 D4.C | C14.+ 42.21,4.63 42.3,4.63 C7.1
  Bottom 0.61: 42.27,4.63 42.08,4.65 C14.+

### Text on the board
Top: TOP
Bottom: BOTTOM
tPlace: 750 | 10k | 0.1uF | P | N | 47k | 4k3 | edgate | Labs | 0.1uF | 0.1uF | 0.1uF | 0.1uF | 10k
_tplace: 750 | 10k | 0.1uF | P | N | 47k | 4k3 | edgate | Labs | 0.1uF | 0.1uF | 4 | 3 | 0.1uF | 0.1uF | 10k | 2 | 1